# EAGLE design so16 (EAGLE 6.6.0)
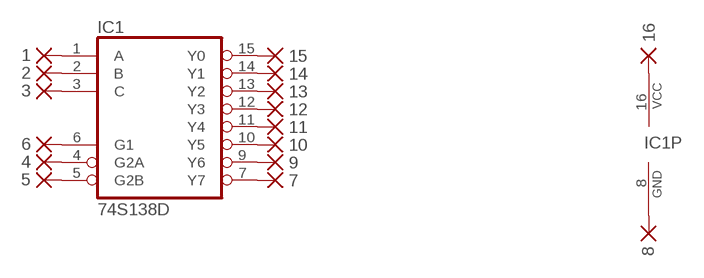
[diagram p0: schematic, sheet 1]

## Parts
1  PAD-0360  [0360]
2  PAD-0360  [0360]
3  PAD-0360  [0360]
4  PAD-0360  [0360]
5  PAD-0360  [0360]
6  PAD-0360  [0360]
7  PAD-0360  [0360]
8  PAD-0360  [0360]
9  PAD-0360  [0360]
10  PAD-0360  [0360]
11  PAD-0360  [0360]
12  PAD-0360  [0360]
13  PAD-0360  [0360]
14  PAD-0360  [0360]
15  PAD-0360  [0360]
16  PAD-0360  [0360]
IC1  74S138D  [SO16]

## Nets
N$1: 16.P$1(P) IC1.16(VCC)
N$2: 8.P$1(P) IC1.8(GND)
N$3: 6.P$1(P) IC1.6(G1)
N$4: 2.P$1(P) IC1.2(B)
N$5: 3.P$1(P) IC1.3(C)
N$6: 1.P$1(P) IC1.1(A)
N$7: 5.P$1(P) IC1.5(G2B)
N$8: 7.P$1(P) IC1.7(Y7)
N$9: 4.P$1(P) IC1.4(G2A)
N$10: 9.P$1(P) IC1.9(Y6)
N$11: 15.P$1(P) IC1.15(Y0)
N$12: 14.P$1(P) IC1.14(Y1)
N$13: 10.P$1(P) IC1.10(Y5)
N$14: 11.P$1(P) IC1.11(Y4)
N$15: 12.P$1(P) IC1.12(Y3)
N$16: 13.P$1(P) IC1.13(Y2)

## Library data of the parts
1-16 = dec-con:PAD: WIRE PAD Standard US Drill Sizes
IC1 = 74xx-us:74*138: 3-line to 8-line DECODER/DEMULTIPLEXER

## Net classes
0 default: width 0.61 mm, clearance 0.508 mm

## Board
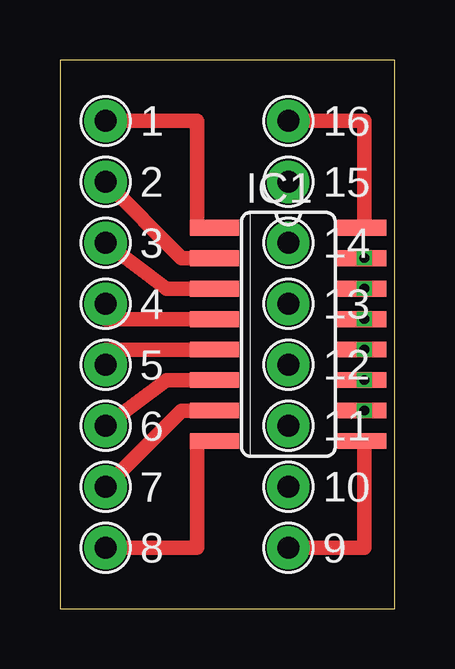
[diagram p1: board, top side]
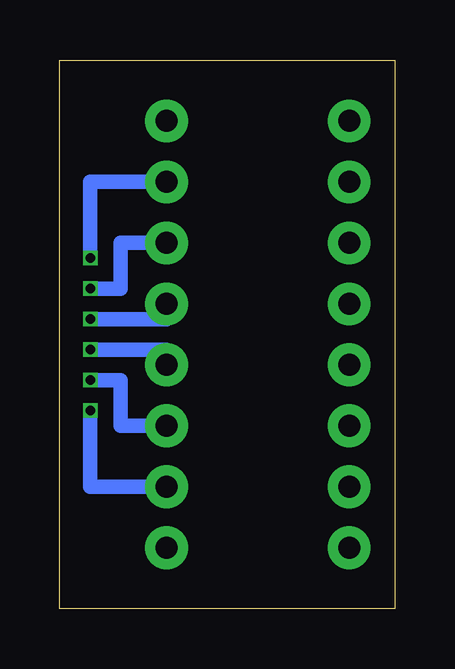
[diagram p2: board, bottom side, seen from below]

Size 13.97 x 22.86 mm. Coordinates in mm from the lower left corner, seen from the top.
Outline: 0,0 13.97,0 13.97,22.86 0,22.86 0,0
Copper layers (1*16): Top 0.035mm / dielectric 1.5mm / Bottom 0.035mm
Design rules "default": minimum track width 10mil, minimum drill 16mil, track to track 8mil, track to pad 8mil, pad to pad 8mil, via to via 8mil, smd to smd 0mil, copper to edge 10mil, drill to drill 8mil, minimum pad ring 10mil, minimum via ring 4mil, stop-mask expansion 4mil, vias tented up to drill 0mil, thermal gap 10mil

### Footprints (pad centres in the part's own frame; a part is rotated, then mirrored left to right if it is on the bottom)
0360 = drill 0.914 pad 1.778: P$1 0,0
SO16 = smd 0.66 x 2.032: 1 -4.445,-3.073; 2 -3.175,-3.073; 3 -1.905,-3.073; 4 -0.635,-3.073; 5 0.635,-3.073; 6 1.905,-3.073; 7 3.175,-3.073; 8 4.445,-3.073; 9 4.445,3.073; 10 3.175,3.073; 11 1.905,3.073; 12 0.635,3.073; 13 -0.635,3.073; 14 -1.905,3.073; 15 -3.175,3.073; 16 -4.445,3.073

### Placement (x,y rotation side)
1  1.91,20.32 0 top
2  1.91,17.78 0 top
3  1.91,15.24 0 top
4  1.91,12.7 0 top
5  1.91,10.16 0 top
6  1.91,7.62 0 top
7  1.91,5.08 0 top
8  1.91,2.54 0 top
9  9.53,2.54 0 top
10  9.53,5.08 0 top
11  9.53,7.62 0 top
12  9.53,10.16 0 top
13  9.53,12.7 0 top
14  9.53,15.24 0 top
15  9.53,17.78 0 top
16  9.53,20.32 0 top
IC1  9.53,11.43 270 top

### Tracks (layer width: path | path; a pad name or v marks a point on that pad's centre or on a via)
N$1
  Top 0.61: 16.P$1 12.7,20.32 12.7,15.88 IC1.16
N$2
  Top 0.61: 8.P$1 5.71,2.54 5.71,6.99 IC1.8
N$3
  Top 0.61: 6.P$1 4.45,9.53 IC1.6
N$4
  Top 0.61: IC1.2 5.08,14.61 2.P$1
N$5
  Top 0.61: 3.P$1 4.45,13.34 IC1.3
N$6
  Top 0.61: 1.P$1 5.71,20.32 5.71,15.88 IC1.1
N$7
  Top 0.61: 5.P$1 1.91,10.79 IC1.5
N$8
  Top 0.61: 7.P$1 5.08,8.26 IC1.7
N$9
  Top 0.61: 4.P$1 1.91,12.06 IC1.4
N$10
  Top 0.61: 9.P$1 12.7,2.54 12.7,6.99 IC1.9
N$11  (via drill 0.41)
  Top 0.61: IC1.15 v12.7,14.61 IC1.15
  Bottom 0.61: 15.P$1 12.7,17.78 v12.7,14.61
N$12  (via drill 0.41)
  Top 0.61: IC1.14 v12.7,13.34 IC1.14
  Bottom 0.61: 14.P$1 11.43,15.24 11.43,13.34 v12.7,13.34
N$13  (via drill 0.41)
  Top 0.61: IC1.10 v12.7,8.26 IC1.10
  Bottom 0.61: 10.P$1 12.7,5.08 v12.7,8.26
N$14  (via drill 0.41)
  Top 0.61: IC1.11 v12.7,9.53 IC1.11
  Bottom 0.61: 11.P$1 11.43,7.62 11.43,9.53 v12.7,9.53
N$15  (via drill 0.41)
  Top 0.61: IC1.12 v12.7,10.79
  Bottom 0.61: 12.P$1 9.53,10.79 IC1.12
N$16  (via drill 0.41)
  Top 0.61: IC1.13 v12.7,12.06
  Bottom 0.61: 13.P$1 9.53,12.06 IC1.13